# Altium schematic sheet DAQ Connector.SchDoc
size A
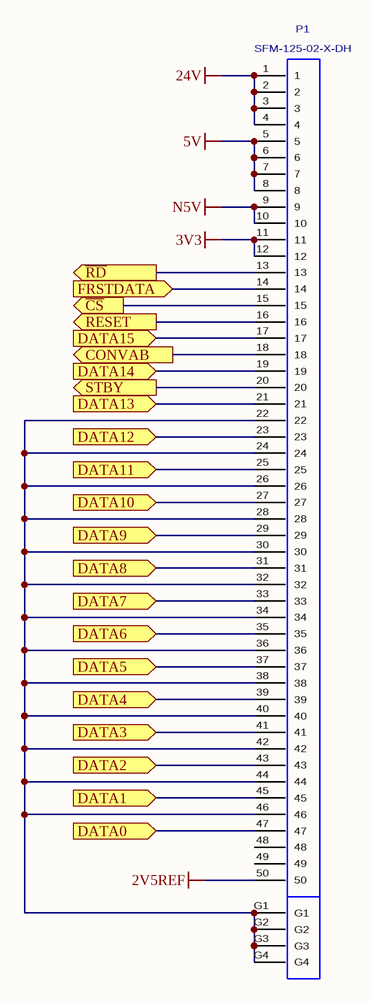
[diagram p0: DAQ Connector.SchDoc]

## Parts
P1  SFM-125-02-X-DH  [SFM-125-02-X-DH]

## Ports
CONVAB (out), DATA0 (in), DATA1 (in), DATA2 (in), DATA3 (in), DATA4 (in), DATA5 (in), DATA6 (in), DATA7 (in), DATA8 (in), DATA9 (in), DATA10 (in), DATA11 (in), DATA12 (in), DATA13 (in), DATA14 (in), DATA15 (in), FRSTDATA (in), RESET (out), STBY (out), ~{CS} (out), ~{RD} (out)

## Nets
2V5REF: P1.50
3V3: P1.11 P1.12
5V: P1.5 P1.6 P1.7 P1.8
24V: P1.1 P1.2 P1.3 P1.4
N5V: P1.9 P1.10
~{CS}: P1.15 ; port ~{CS}
CONVAB: P1.18 ; port CONVAB
DATA0: P1.47 ; port DATA0
DATA1: P1.45 ; port DATA1
DATA2: P1.43 ; port DATA2
DATA3: P1.41 ; port DATA3
DATA4: P1.39 ; port DATA4
DATA5: P1.37 ; port DATA5
DATA6: P1.35 ; port DATA6
DATA7: P1.33 ; port DATA7
DATA8: P1.31 ; port DATA8
DATA9: P1.29 ; port DATA9
DATA10: P1.27 ; port DATA10
DATA11: P1.25 ; port DATA11
DATA12: P1.23 ; port DATA12
DATA13: P1.21 ; port DATA13
DATA14: P1.19 ; port DATA14
DATA15: P1.17 ; port DATA15
FRSTDATA: P1.14 ; port FRSTDATA
~{RD}: P1.13 ; port ~{RD}
RESET: P1.16 ; port RESET
STBY: P1.20 ; port STBY
NetP1_22: P1.22 P1.24 P1.26 P1.28 P1.30 P1.32 P1.34 P1.36 P1.38 P1.40 P1.42 P1.44 P1.46 P1.G1 P1.G2 P1.G3 P1.G4

Not connected (* = marked no-connect by the designer): P1 48 49

## Library data of the parts
P1 = SFM-125-02-X-DH: .050" (1,27mm) Tiger Eye Contact, Molded-to-Position Socket Strip, Double Horizontal.; MANUFACTURER: SAMTEC; CREATED: October 28, 2015 - Wendy Xin; PCB DECAL: SFM-125-02-X-DH